# EAGLE design PlantBuddy (EAGLE 7.2.0)
CNAME: OrthogonalResearch; CREVISION: 0.1; DESIGNER: Andy Alexander
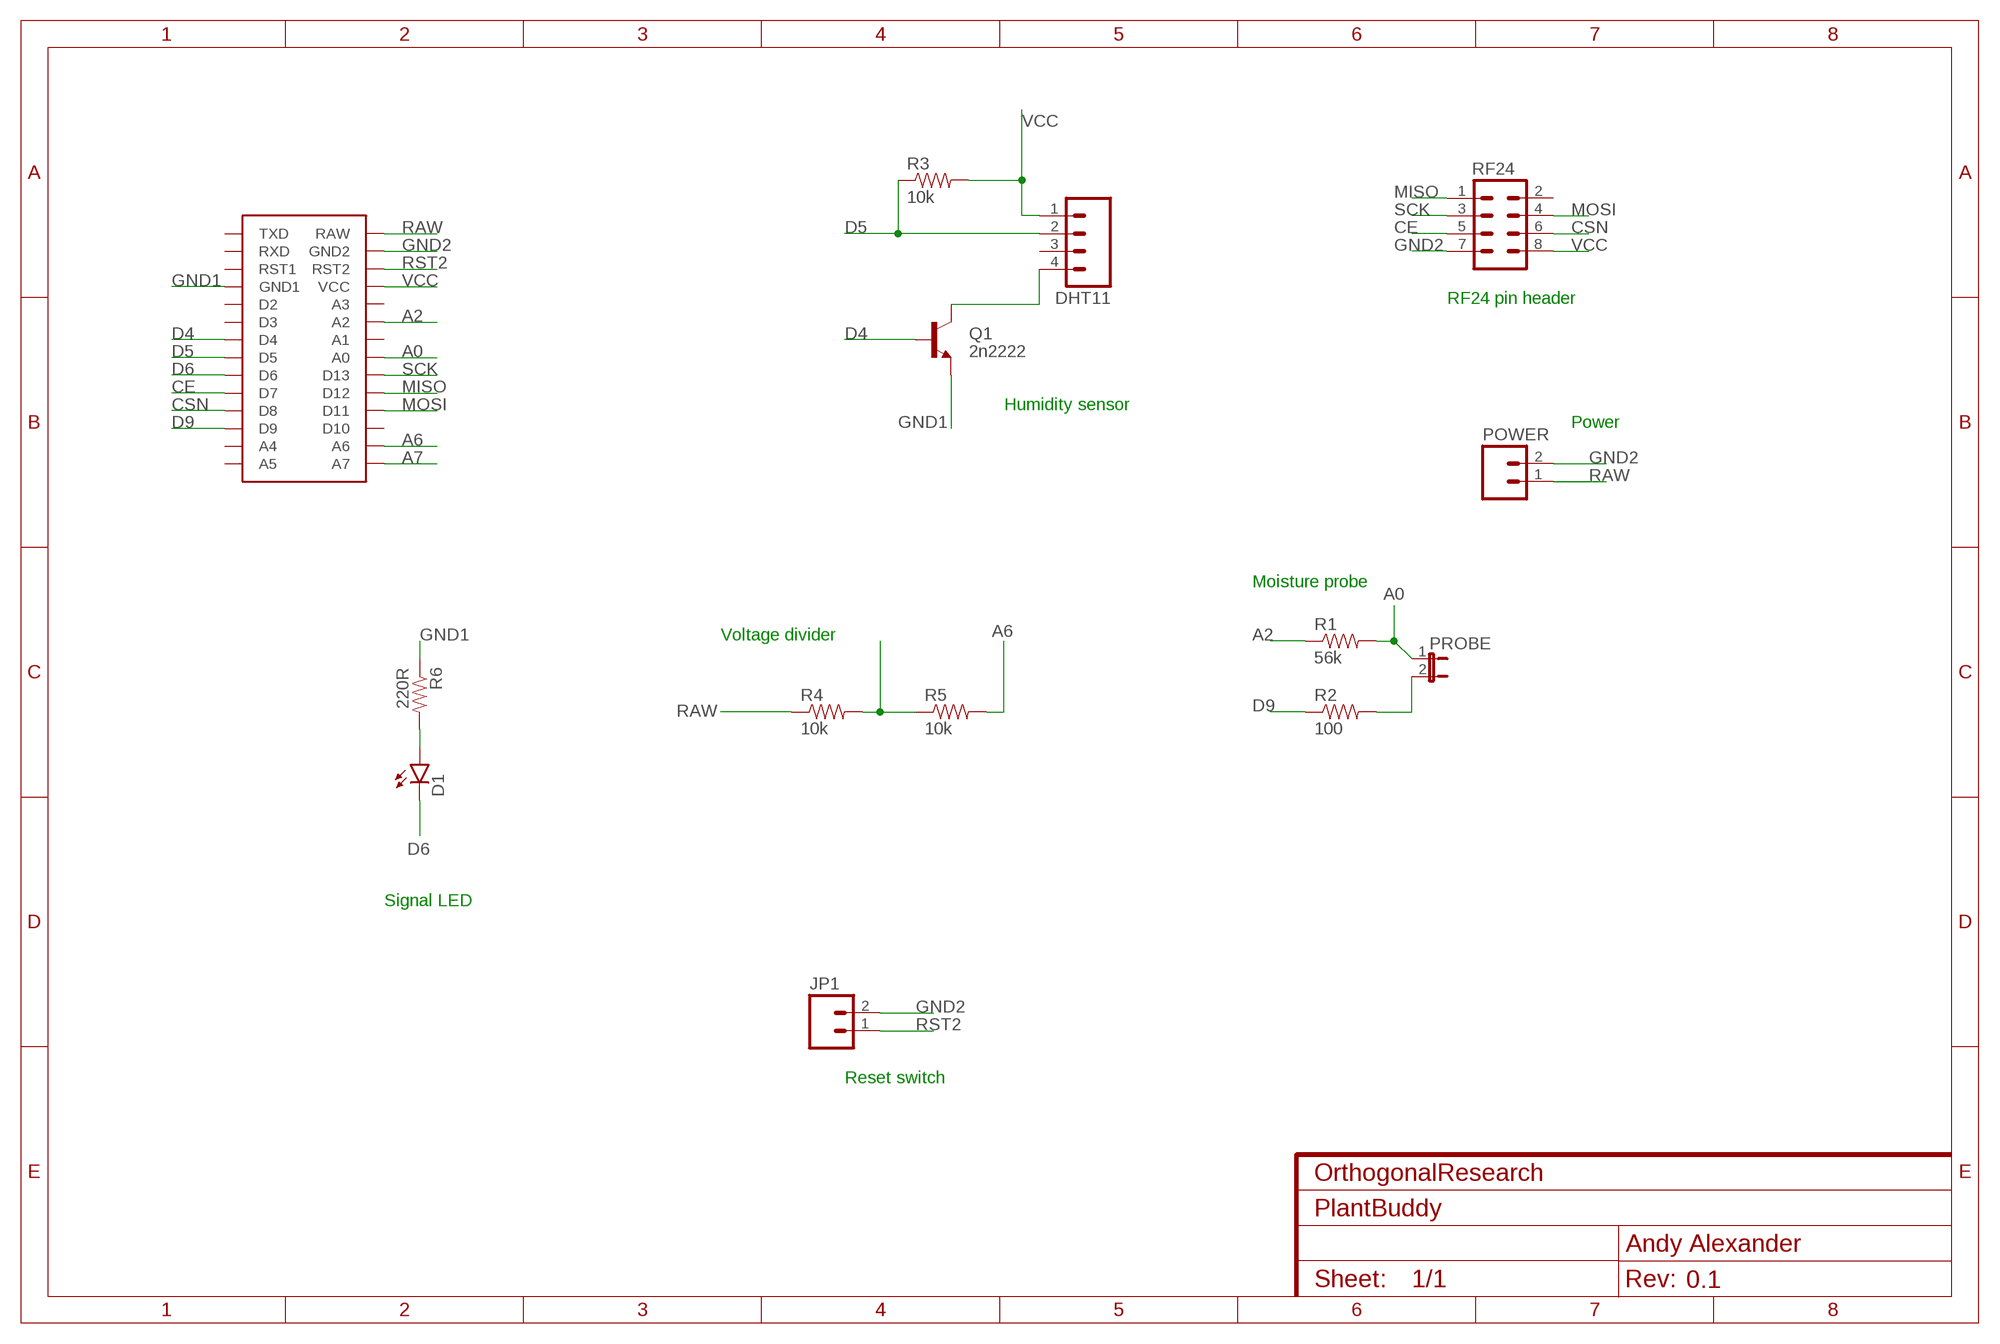
[diagram p0: schematic, sheet 1]

## Parts
D1  LED5MM  [LED5MM]
DHT11  M04PTH  [1X04]
JP1  M021X02_NO_SILK  [1X02_NO_SILK]
POWER  M021X02_NO_SILK  [1X02_NO_SILK]
PROBE  JUMPER-2PTH  [1X02]
Q1  2n2222  TRANSISTOR_NPNBC547  [TO-92-AMMO]
R1  56k  RESISTORKIT  [AXIAL-0.3-KIT]
R2  100  RESISTORKIT  [AXIAL-0.3-KIT]
R3  10k  RESISTORKIT  [AXIAL-0.3-KIT]
R4  10k  RESISTORKIT  [AXIAL-0.3-KIT]
R5  10k  RESISTORKIT  [AXIAL-0.3-KIT]
R6  220R  RESISTORKIT  [AXIAL-0.3-KIT]
RF24  M04X2  [2X4]
U$1  PRO-MINIPRO-MINI-328P_1  [PRO-MINI]

## Nets
A0: PROBE.1 R1.P$2 U$1.P$20(A0)
A2: R1.P$1 U$1.P$18(A2)
A6: R5.P$2 U$1.P$39(A6)
A7: R4.P$2 R5.P$1 U$1.P$40(A7)
CE: RF24.5 U$1.P$10(D7)
CSN: RF24.6 U$1.P$11(D8)
D4: Q1.2(B) U$1.P$7(D4)
D5: DHT11.2 R3.P$1 U$1.P$8(D5)
D6: D1.K(C) U$1.P$9(D6)
D9: R2.P$1 U$1.P$12(D9)
GND1: Q1.3(E) R6.P$1 U$1.P$4(GND1)
GND2: JP1.2 POWER.2 RF24.7 U$1.P$14(GND2)
MISO: RF24.1 U$1.P$22(D12)
MOSI: RF24.4 U$1.P$23(D11)
N$4: PROBE.2 R2.P$2
N$5: DHT11.4 Q1.1(C)
N$6: D1.A R6.P$2
RAW: POWER.1 R4.P$1 U$1.P$13(RAW)
RST2: JP1.1 U$1.P$15(RST2)
SCK: RF24.3 U$1.P$21(D13)
VCC: DHT11.1 R3.P$2 RF24.8 U$1.P$16(VCC)
Unconnected: DHT11.3 RF24.2 U$1.P$2(RXD) U$1.P$3(RST1) U$1.P$5(D2) U$1.P$6(D3) U$1.P$17(A3) U$1.P$19(A1) U$1.P$24(D10) U$1.P$34(A4) U$1.P$35(A5) U$1.TDX(TXD)

## Notes on the sheet
- RF24 pin header
- Humidity sensor
- Power
- Moisture probe
- Voltage divider
- Signal LED
- Reset switch

## Library data of the parts
D1 = SparkFun-LED:LED: LEDs Standard schematic elements and footprints for 5mm, 3mm, 1206, and 0603 sized LEDs. 5mm - Spark Fun Electronics SKU : COM-00529 (and others)
DHT11 = SparkFun-Connectors:M04: Header 4 Standard 4-pin 0.1" header. Use with straight break away headers (SKU : PRT-00116), right angle break away headers (PRT-00553), swiss pins (PRT-00743), machine pins (PRT-00117), and female headers (PRT-00115). Molex polarized connector foot print use with SKU : PRT-08231 with associated crimp pins and housings. 1MM SMD Version SKU: PRT-10208
JP1 POWER = SparkFun-Connectors:M02: Standard 2-pin 0.1" header. Use with - straight break away headers ( PRT-00116) - right angle break away headers (PRT-00553) - swiss pins (PRT-00743) - machine pins (PRT-00117) - female headers (PRT-00115) Molex polarized connector foot print use with: PRT-08233 with associated crimp pins and housings. 2.54_SCREWTERM for use with PRT-10571. 3.5mm Screw Terminal footprints for PRT-08084 5mm Screw Terminal footprints for use with PRT-08432
PROBE = SparkFun-Retired:JUMPER-2: Jumper Basic 0.1" spaced jumper. Use with breakaway headers.
Q1 = SparkFun-DiscreteSemi:TRANSISTOR_NPN: Generic NPN BJT MMBT2222A - TRANS-08049 (SOT-23, 1A 40V) MPSA42 - TRANS-09116 (SOT-23, 500mA 300V) MMBT5088LT1G - TRANS-11160 (SOT-23, 50 mA 30V) BC547 - COM-08928 <http://www.sparkfun.com/products/8928> (TO-92 45V 100mA) (1.Collector 2.Base 3.Emitter) 2N3904 - COM-00521 <http://www.sparkfun.com/products/521> (TO-92 40V 200mA) (1.Emitter 2.Base 3.Collector) P2N2222A - COM-12852 <http://www.sparkfun.com/products/12852> (TO-92 40V 600mA) (1.Collector 2.Base 3.Emitter)
R1-R5 = SparkFun-Resistors:RESISTOR: Resistor Basic schematic elements and footprints for 0603, 1206, and PTH resistors.
R6 = SparkFun-Passives:RESISTOR: Resistor Basic schematic elements and footprints for 0603, 1206, and PTH resistors.
RF24 = SparkFun-Connectors:M04X2: .1" header, two rows of four.
U$1 = PRO-MINI-328P_1:PRO-MINI: PRO-MINI-328P Dual layer bottom row

## Board
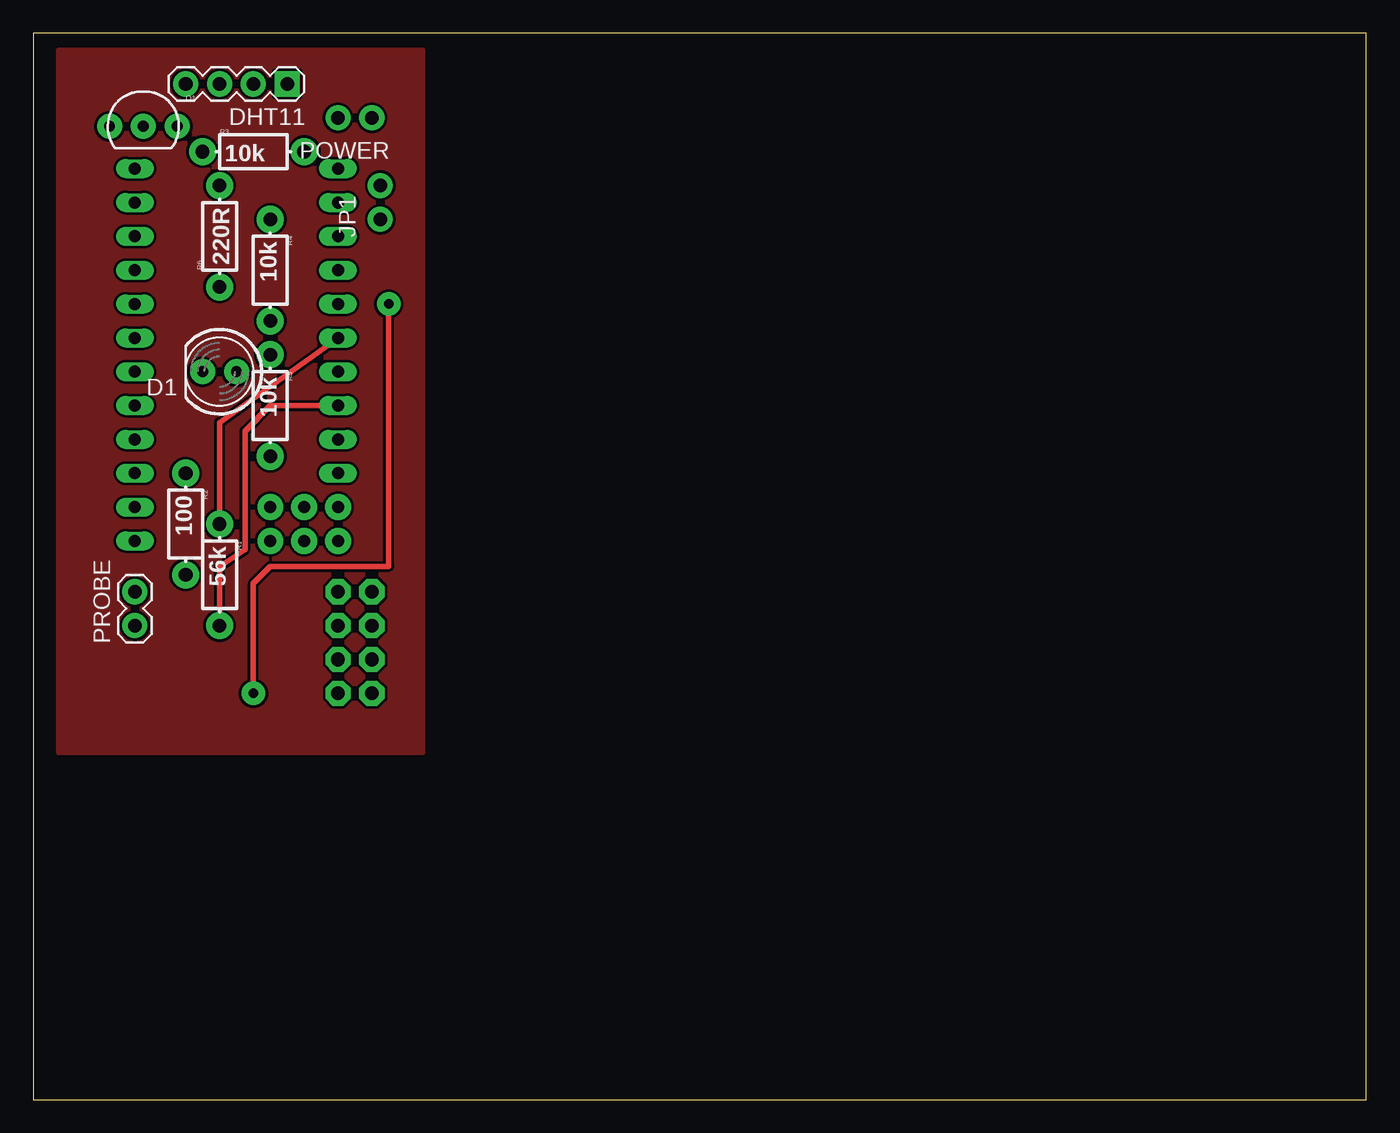
[diagram p1: board, top side]
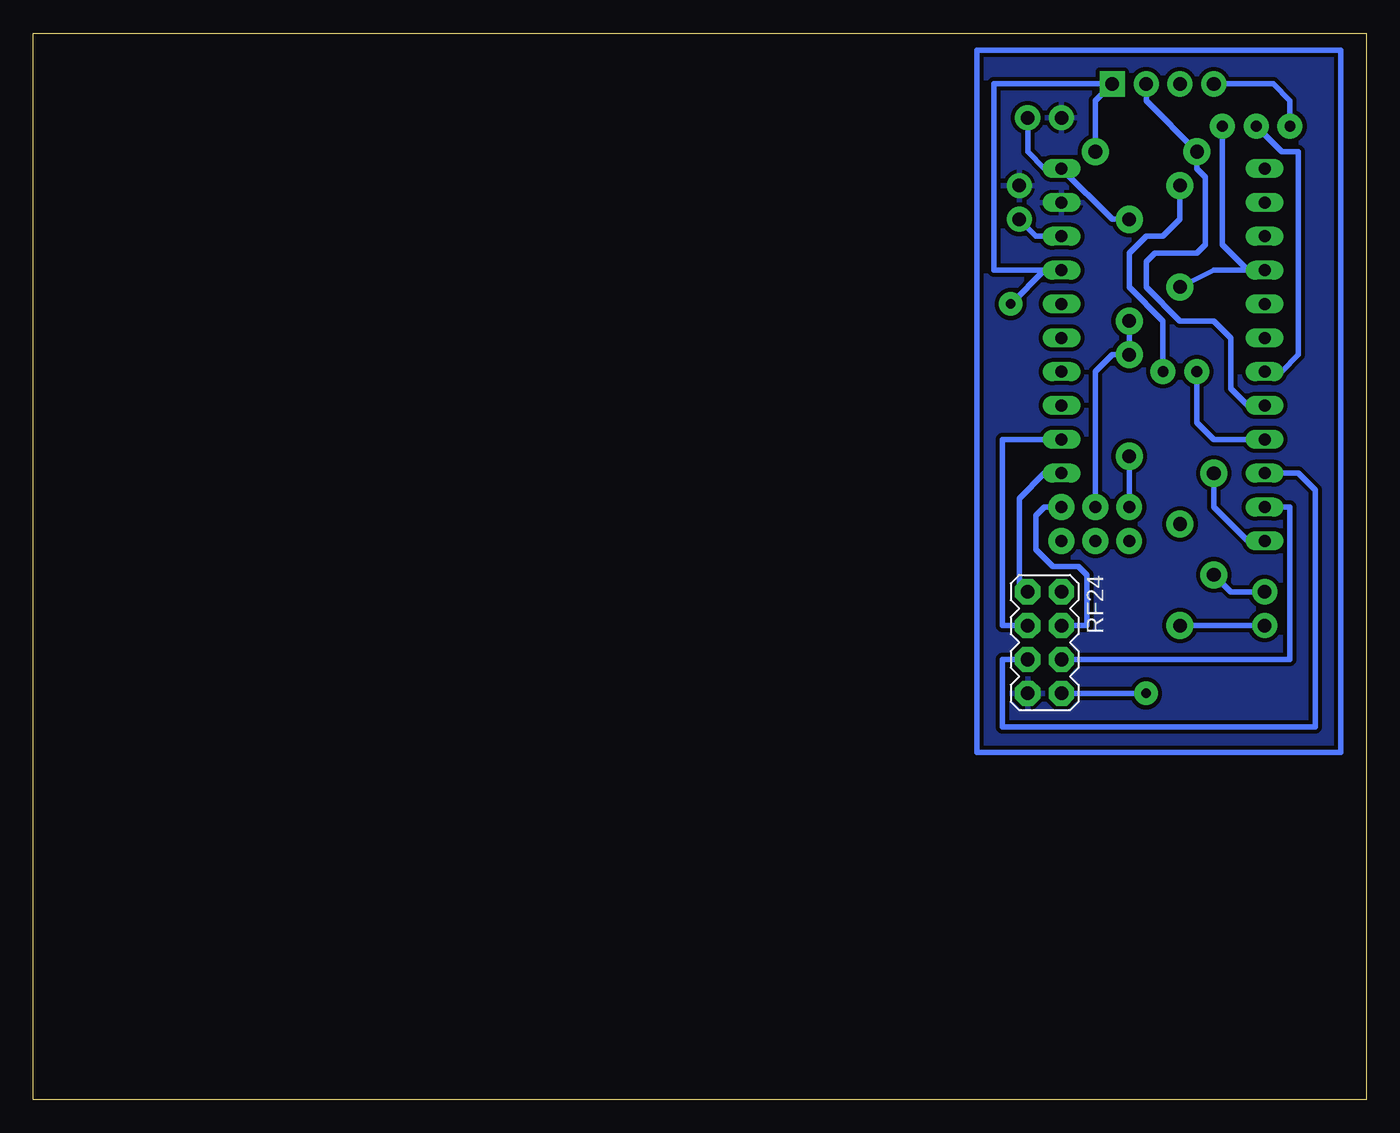
[diagram p2: board, bottom side, seen from below]

Size 100 x 80 mm. Coordinates in mm from the lower left corner, seen from the top.
Outline: 0,0 100,0 100,80 0,80 0,0
Copper layers (1*16): Top 0.035mm / dielectric 1.5mm / Bottom 0.035mm
Design rules "default": minimum track width 10mil, minimum drill 24mil, track to track 8mil, track to pad 8mil, pad to pad 8mil, via to via 8mil, smd to smd 8mil, copper to edge 40mil, drill to drill 8mil, minimum pad ring 10mil, minimum via ring 8mil, stop-mask expansion 4mil, vias tented up to drill 0mil, thermal gap 10mil

### Footprints (pad centres in the part's own frame; a part is rotated, then mirrored left to right if it is on the bottom)
LED5MM = drill 0.813 pad 1.88: A -1.27,0; K 1.27,0
1X04 = drill 1.016 pad 1.88 square: 1 0,0 | drill 1.016 pad 1.88: 2 2.54,0; 3 5.08,0; 4 7.62,0
1X02_NO_SILK = drill 1.016 pad 1.88: 1 0,0; 2 2.54,0
1X02 = drill 1.016 pad 1.88: 1 0,0; 2 2.54,0
TO-92-AMMO = drill 0.813 pad 1.88: 1 -2.54,0; 2 0,0; 3 2.54,0
AXIAL-0.3-KIT = drill 1.016 pad 2.032: P$1 -3.81,0; P$2 3.81,0
2X4 = drill 1.016 pad 1.88 octagon: 1 -3.81,-1.27; 2 -3.81,1.27; 3 -1.27,-1.27; 4 -1.27,1.27; 5 1.27,-1.27; 6 1.27,1.27; 7 3.81,-1.27; 8 3.81,1.27
PRO-MINI = drill 0.9 long: P$2 -7.62,12.7; P$3 -7.62,10.16; P$4 -7.62,7.62; P$5 -7.62,5.08; P$6 -7.62,2.54; P$7 -7.62,0; P$8 -7.62,-2.54; P$9 -7.62,-5.08; P$10 -7.62,-7.62; P$11 -7.62,-10.16; P$12 -7.62,-12.7; P$13 7.62,15.24; P$14 7.62,12.7; P$15 7.62,10.16; P$16 7.62,7.62; P$17 7.62,5.08; P$18 7.62,2.54; P$19 7.62,0; P$20 7.62,-2.54; P$21 7.62,-5.08; P$22 7.62,-7.62; TDX -7.62,15.24 | drill 0.9 pad 1.93: P$23 7.62,-10.16; P$24 7.62,-12.7; P$34 2.54,-12.7; P$35 5.08,-12.7; P$39 2.54,-10.16; P$40 5.08,-10.16

### Placement (x,y rotation side)
D1  13.97,54.61 180 top
DHT11  19.05,76.2 180 top
JP1  26.04,66.04 90 top
POWER  25.4,73.66 180 top
PROBE  7.62,35.56 90 top
Q1  8.26,73.03 0 top
R1  13.97,39.37 270 top
R2  11.43,43.18 270 top
R3  16.51,71.12 0 top
R4  17.78,62.23 270 top
R5  17.78,52.07 270 top
R6  13.97,64.77 90 top
RF24  24.13,34.29 270 bottom
U$1  15.24,54.61 0 top

### Tracks (layer width: path | path; a pad name or v marks a point on that pad's centre or on a via)
A0
  Top 0.406: R1.P$2 13.97,40.01 15.88,41.27 15.88,50.16 17.78,52.07 U$1.P$20
  Bottom 0.406: PROBE.1 R1.P$2
A2
  Top 0.406: R1.P$1 13.97,50.8 U$1.P$18
A6
  Bottom 0.406: U$1.P$39 R5.P$2
A7
  Bottom 0.406: R4.P$2 R5.P$1 19.05,55.88 20.32,54.61 U$1.P$40
CE
  Bottom 0.406: U$1.P$10 5.08,46.99 3.81,45.72 3.81,27.94 27.3,27.94 27.3,33.02 RF24.5
CSN
  Bottom 0.406: U$1.P$11 5.71,44.45 5.71,33.02 RF24.6
D4
  Bottom 0.406: U$1.P$7 6.35,54.61 5.08,55.88 5.08,71.12 6.35,71.12 Q1.2
D5
  Bottom 0.406: DHT11.2 16.51,74.93 R3.P$1 12.7,69.85 12.06,69.22 12.06,64.14 12.7,63.5 15.88,63.5 16.51,62.87 16.51,60.96 13.97,58.42 11.43,58.42 10.16,57.15 10.16,53.34 8.89,52.07 U$1.P$8
D6
  Bottom 0.406: 12.7,53.34 D1.K 12.7,50.8 11.43,49.53 U$1.P$9
D9
  Bottom 0.406: U$1.P$12 8.89,41.91 11.43,44.45 R2.P$1
GND1
  Bottom 0.406: U$1.P$4 8.89,62.23 | 8.89,62.23 11.43,62.23 R6.P$1 | Q1.3 10.79,64.14 8.89,62.23
GND2
  pour Bottom (isolate 0.305): 29.21,78.74 1.27,78.74 1.27,26.04 29.21,26.04
MISO
  Bottom 0.406: U$1.P$22 24.13,46.99 26.04,45.09 26.04,38.73 RF24.1
MOSI
  Bottom 0.406: RF24.4 20.95,35.56 20.95,39.37 21.59,40.01 23.5,40.01 24.77,41.27 24.77,43.81 24.13,44.45 U$1.P$23
N$1
  Bottom 0.406: 1.91,78.74 29.21,78.74 29.21,26.04 1.91,26.04 1.91,78.74
N$2
  pour Top: 1.91,78.74 29.21,78.74 29.21,26.04 1.91,26.04
N$4
  Bottom 0.406: PROBE.2 10.16,38.1 R2.P$2
N$5
  Bottom 0.406: Q1.1 5.71,74.93 6.99,76.2 DHT11.4
N$6
  Bottom 0.406: R6.P$2 13.97,66.04 15.24,64.77 16.51,64.77 17.78,63.5 17.78,60.96 15.24,58.42 D1.A
RAW
  Bottom 0.406: R4.P$1 19.05,66.04 U$1.P$13 24.13,69.85 25.4,71.12 POWER.1
RST2
  Bottom 0.406: U$1.P$15 24.77,64.77 JP1.1
SCK
  Bottom 0.406: RF24.3 27.3,35.56 27.3,49.53 U$1.P$21
VCC  (via drill 0.7 pad 1.78)
  Top 0.406: v16.51,30.48 16.51,38.73 17.78,40.01 26.67,40.01 v26.67,59.69
  Bottom 0.406: R3.P$2 20.32,74.93 DHT11.1 27.94,76.2 27.94,62.23 U$1.P$16 24.13,62.23 v26.67,59.69 | RF24.8 v16.51,30.48